# EAGLE schematic ece411brd (EAGLE 9.2.1)
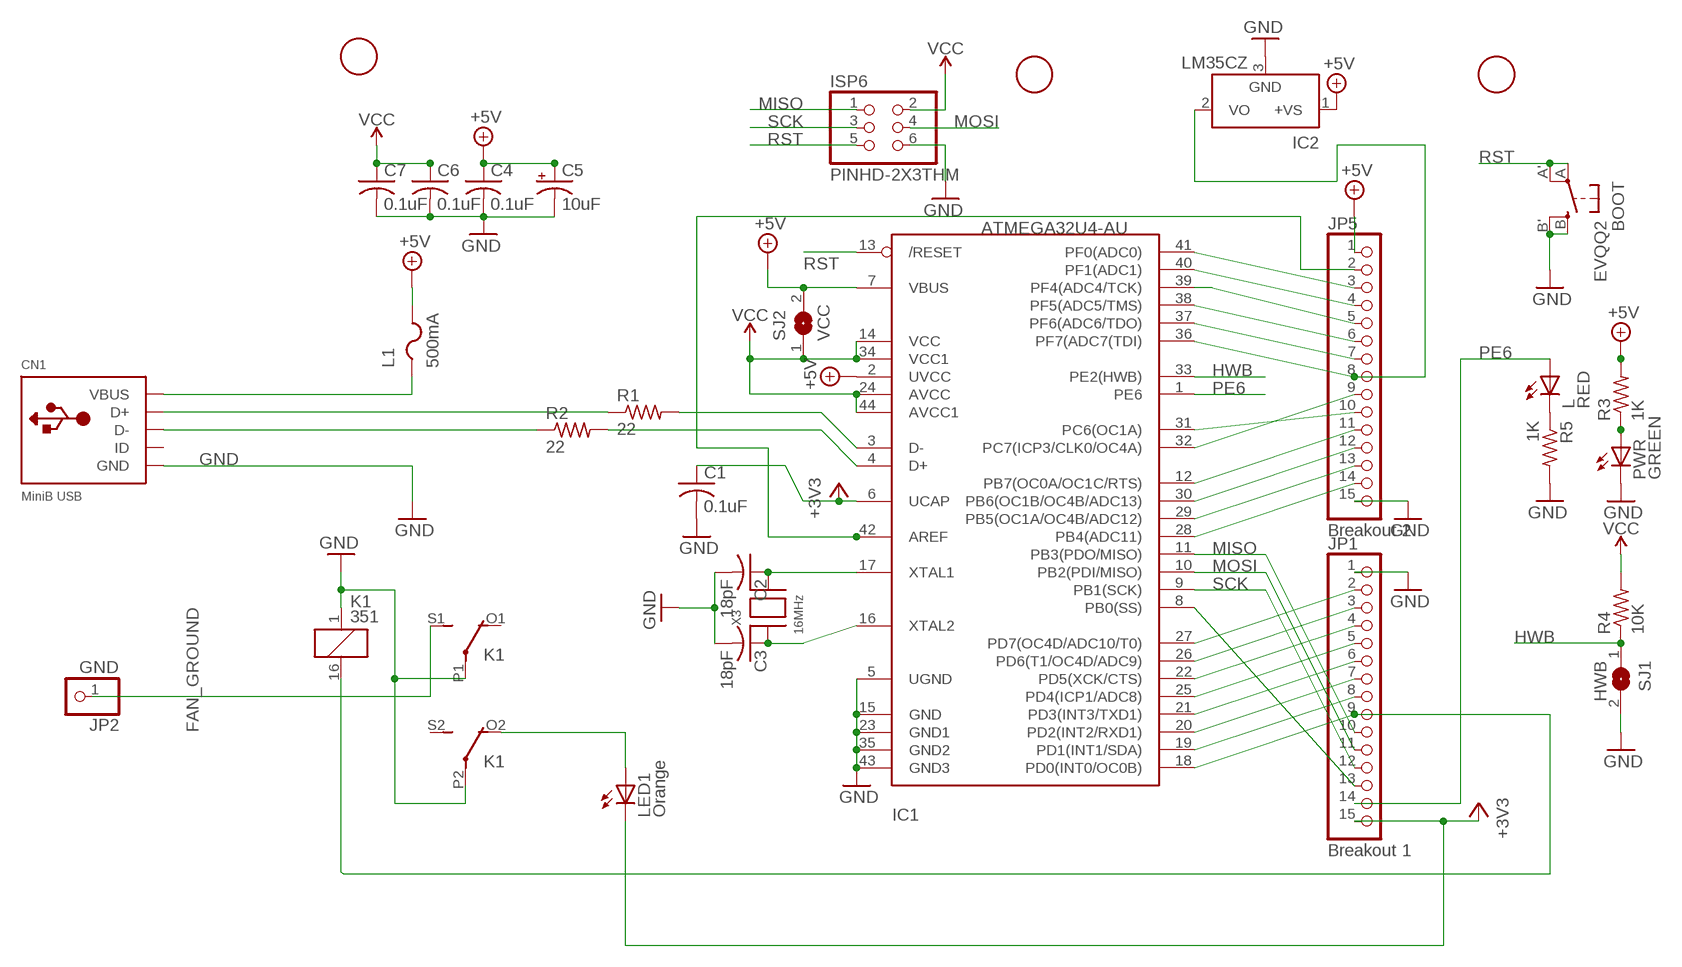
[diagram p0: schematic, sheet 1]

## Parts
BOOT  EVQQ2  [EVQ-Q2]
C1  0.1uF  C-USC0805K  [C0805K]
C2  18pF  C-USC0805K  [C0805K]
C3  18pF  C-USC0805K  [C0805K]
C4  0.1uF  C-USC0805K  [C0805K]
C5  10uF  CPOL-USA/3216-18R  [A/3216-18R]
C6  0.1uF  C-USC0805K  [C0805K]
C7  0.1uF  C-USC0805K  [C0805K]
CN1  MiniB USB  USBMINIB  [USB-MINIB]
IC1  ATMEGA32U4-AU  [TQFP44]
IC2  LM35CZ  [TO92]
ISP6  PINHD-2X3THM  [ISP6]
JP1  Breakout 1  PINHD-1X15-CB  [1X15-CB]
JP2  GND  PINHD-1X1  [1X01]
JP5  Breakout 2  PINHD-1X15-CB  [1X15-CB]
K1  351  [351]
L  RED  LEDCHIPLED_0805  [CHIPLED_0805]
L1  500mA  PTCFUSE-1206  [R1206]
LED1  Orange  LED3MM  [LED3MM]
PWR  GREEN  LEDCHIPLED_0805  [CHIPLED_0805]
R1  22  R-US_R0805  [R0805]
R2  22  R-US_R0805  [R0805]
R3  1K  R-US_R0805  [R0805]
R4  10K  R-US_R0805  [R0805]
R5  1K  R-US_R0805  [R0805]
SJ1  HWB  SJ  [SJ]
SJ2  VCC  SJ  [SJ]
U$1  FIDUCIAL  [FIDUCIAL_1MM]
U$2  FIDUCIAL  [FIDUCIAL_1MM]
U$6  FIDUCIAL  [FIDUCIAL_1MM]
X3  16MHz  XTALNX5032  [NX5032]

## Nets
+3V3: C1.1 IC1.6(UCAP) JP1.15 LED1.K(C)
+5V: C4.1 C5.+ IC1.2(UVCC) IC1.7(VBUS) IC2.1(+VS) JP5.1 L1.2 R3.2 SJ2.2
FAN_GROUND: JP2.1 K1.S1(2:S)
GND: BOOT.B'(S1) BOOT.B(S) C1.2 C2.2 C3.2 C4.2 C5.- C6.2 C7.2 CN1.GND IC1.5(UGND) IC1.15(GND) IC1.23(GND1) IC1.35(GND2) IC1.43(GND3) IC2.3(GND) ISP6.6 JP1.1 JP5.15 K1.1 K1.P1(2:P) K1.P2(3:P) PWR.C R5.2 SJ1.2
HWB: IC1.33(PE2(HWB)) R4.1 SJ1.1
MISO: IC1.11(PB3(PDO/MISO)) ISP6.1 JP1.10
MOSI: IC1.10(PB2(PDI/MISO)) ISP6.4 JP1.11
N$1: PWR.A R3.1
N$2: CN1.D- R2.1
N$3: IC1.3(D-) R1.2
N$4: IC1.4(D+) R2.2
N$5: CN1.D+ R1.1
N$6: IC1.42(AREF) JP5.2
N$7: IC1.37(PF6(ADC6/TDO)) JP5.7
N$8: C2.1 IC1.17(XTAL1) X3.P$2
N$9: C3.1 IC1.16(XTAL2) X3.P$1
N$10: L.C R5.1
N$12: K1.O2(3:O) LED1.A
PB0: IC1.8(PB0(SS)) JP1.13
PB4: IC1.28(PB4(ADC11)) JP5.14
PB5: IC1.29(PB5(OC1A/OC4B/ADC12)) JP5.13
PB6: IC1.30(PB6(OC1B/OC4B/ADC13)) JP5.12
PB7: IC1.12(PB7(OC0A/OC1C/RTS)) JP5.11
PC6: IC1.31(PC6(OC1A)) JP5.10
PC7: IC1.32(PC7(ICP3/CLK0/OC4A)) JP5.9
PD0: IC1.18(PD0(INT0/OC0B)) JP1.9 K1.16
PD1: IC1.19(PD1(INT1/SDA)) JP1.8
PD2: IC1.20(PD2(INT2/RXD1)) JP1.7
PD3: IC1.21(PD3(INT3/TXD1)) JP1.6
PD4: IC1.25(PD4(ICP1/ADC8)) JP1.5
PD5: IC1.22(PD5(XCK/CTS)) JP1.4
PD6: IC1.26(PD6(T1/OC4D/ADC9)) JP1.3
PD7: IC1.27(PD7(OC4D/ADC10/T0)) JP1.2
PE6: IC1.1(PE6) JP1.14 L.A
PF0: IC1.41(PF0(ADC0)) JP5.3
PF1: IC1.40(PF1(ADC1)) JP5.4
PF4: IC1.39(PF4(ADC4/TCK)) JP5.5
PF5: IC1.38(PF5(ADC5/TMS)) JP5.6
PF7: IC1.36(PF7(ADC7(TDI)) IC2.2(VO) JP5.8
RST: BOOT.A'(P1) BOOT.A(P) IC1.13(/RESET) ISP6.5
SCK: IC1.9(PB1(SCK)) ISP6.3 JP1.12
VBUS: CN1.VBUS L1.1
VCC: C6.1 C7.1 IC1.14(VCC) IC1.24(AVCC) IC1.34(VCC1) IC1.44(AVCC1) ISP6.2 R4.2 SJ2.1
Unconnected: CN1.ID K1.O1(2:O) K1.S2(3:S)

## Library data of the parts
BOOT = adaprog:EVQQ2
C1-C4 C6 C7 = adafruit:C-US: CAPACITOR, American symbol
C5 = adafruit:CPOL-US: POLARIZED CAPACITOR, American symbol
CN1 = adafruit:USB: USB Connectors USBMINIB - Surface Mount Female Mini-B USB Connector 4UConnector: 06564 By microbuilder.eu Thru-hole RA Female Mini-B USB Connector 4UConnector: 18732 By ladyada.net
IC1 = adaprog:ATMEGA32U4
IC2 = lm35:LM35: Single-Supply Centigrade Temperature Sensor Vout = (10mV/°C x Temp °C) +5mmmV Source: http://www.national.com/ds/LM/LM35.pdf
ISP6 = adaprog:PINHD-2X3
JP1 JP5 = adafruit:PINHD-1X15: PIN HEADER
JP2 = adafruit:PINHD-1X1: Pin header 1x1 for 0.1" spacing With round pins
K1 = relay:351: RELAY 2 x switch, Omron; OC_FARNELL: unknown; OC_NEWARK: unknown
L LED1 PWR = adafruit:LED: LED OSRAM: - CHIPLED LG R971, LG N971, LY N971, LG Q971, LY Q971, LO R971, LY R971 LH N974, LH R974 LS Q976, LO Q976, LY Q976 LO Q996 - Hyper CHIPLED LW Q18S LB Q993, LB Q99A, LB R99A - SideLED LS A670, LO A670, LY A670, LG A670, LP A670 LB A673, LV A673, LT A673, LW A673 LH A674 LY A675 LS A676, LA A676, LO A676, LY A676, LW A676 LS A679, LY A679, LG A679 - Hyper Micro SIDELED® LS Y876, LA Y876, LO Y876, LY Y876 LT Y87S - SmartLED LW L88C, LW L88S LB L89C, LB L89S, LG L890 LS L89K, LO L89K, LY L89K LS L896, LA L896, LO L896, LY L896 - TOPLED LS T670, LO T670, LY T670, LG T670, LP T670 LSG T670, LSP T670, LSY T670, LOP T670, LYG T670 LG T671, LOG T671, LSG T671 LB T673, LV T673, LT T673, LW T673 LH T674 LS T676, LA T676, LO T676, LY T676, LB T676, LH T676, LSB T676, LW T676 LB T67C, LV T67C, LT T67C, LS T67K, LO T67K, LY T67K, LW E67C LS E67B, LA E67B, LO E67B, LY E67B, LB E67C, LV E67C, LT E67C LW T67C LS T679, LY T679, LG T679 LS T770, LO T770, LY T770, LG T770, LP T770 LB T773, LV T773, LT T773, LW T773 LH T774 LS E675, LA E675, LY E675, LS T675 LS T776, LA T776, LO T776, LY T776, LB T776 LHGB T686 LT T68C, LB T68C - Hyper Mini TOPLED® LB M676 - Mini TOPLED Santana® LG M470 LS M47K, LO M47K, LY M47K Source: http://www.osram.convergy.de/
L1 = adafruit:PTCFUSE: PTC fuses, resettable thermistors
R1-R5 = adafruit:R-US_: RESISTOR, American symbol
SJ1 SJ2 = jumper:SJ: SMD solder JUMPER
U$1 U$2 U$6 = adafruit:FIDUCIAL: For use by pick and place machines to calibrate the vision/machine, 1mm By microbuilder.eu
X3 = adaprog:XTAL